# Altium schematic sheet Pedal_Power.SchDoc
size A3; SheetNumber: 1; SheetTotal: 1
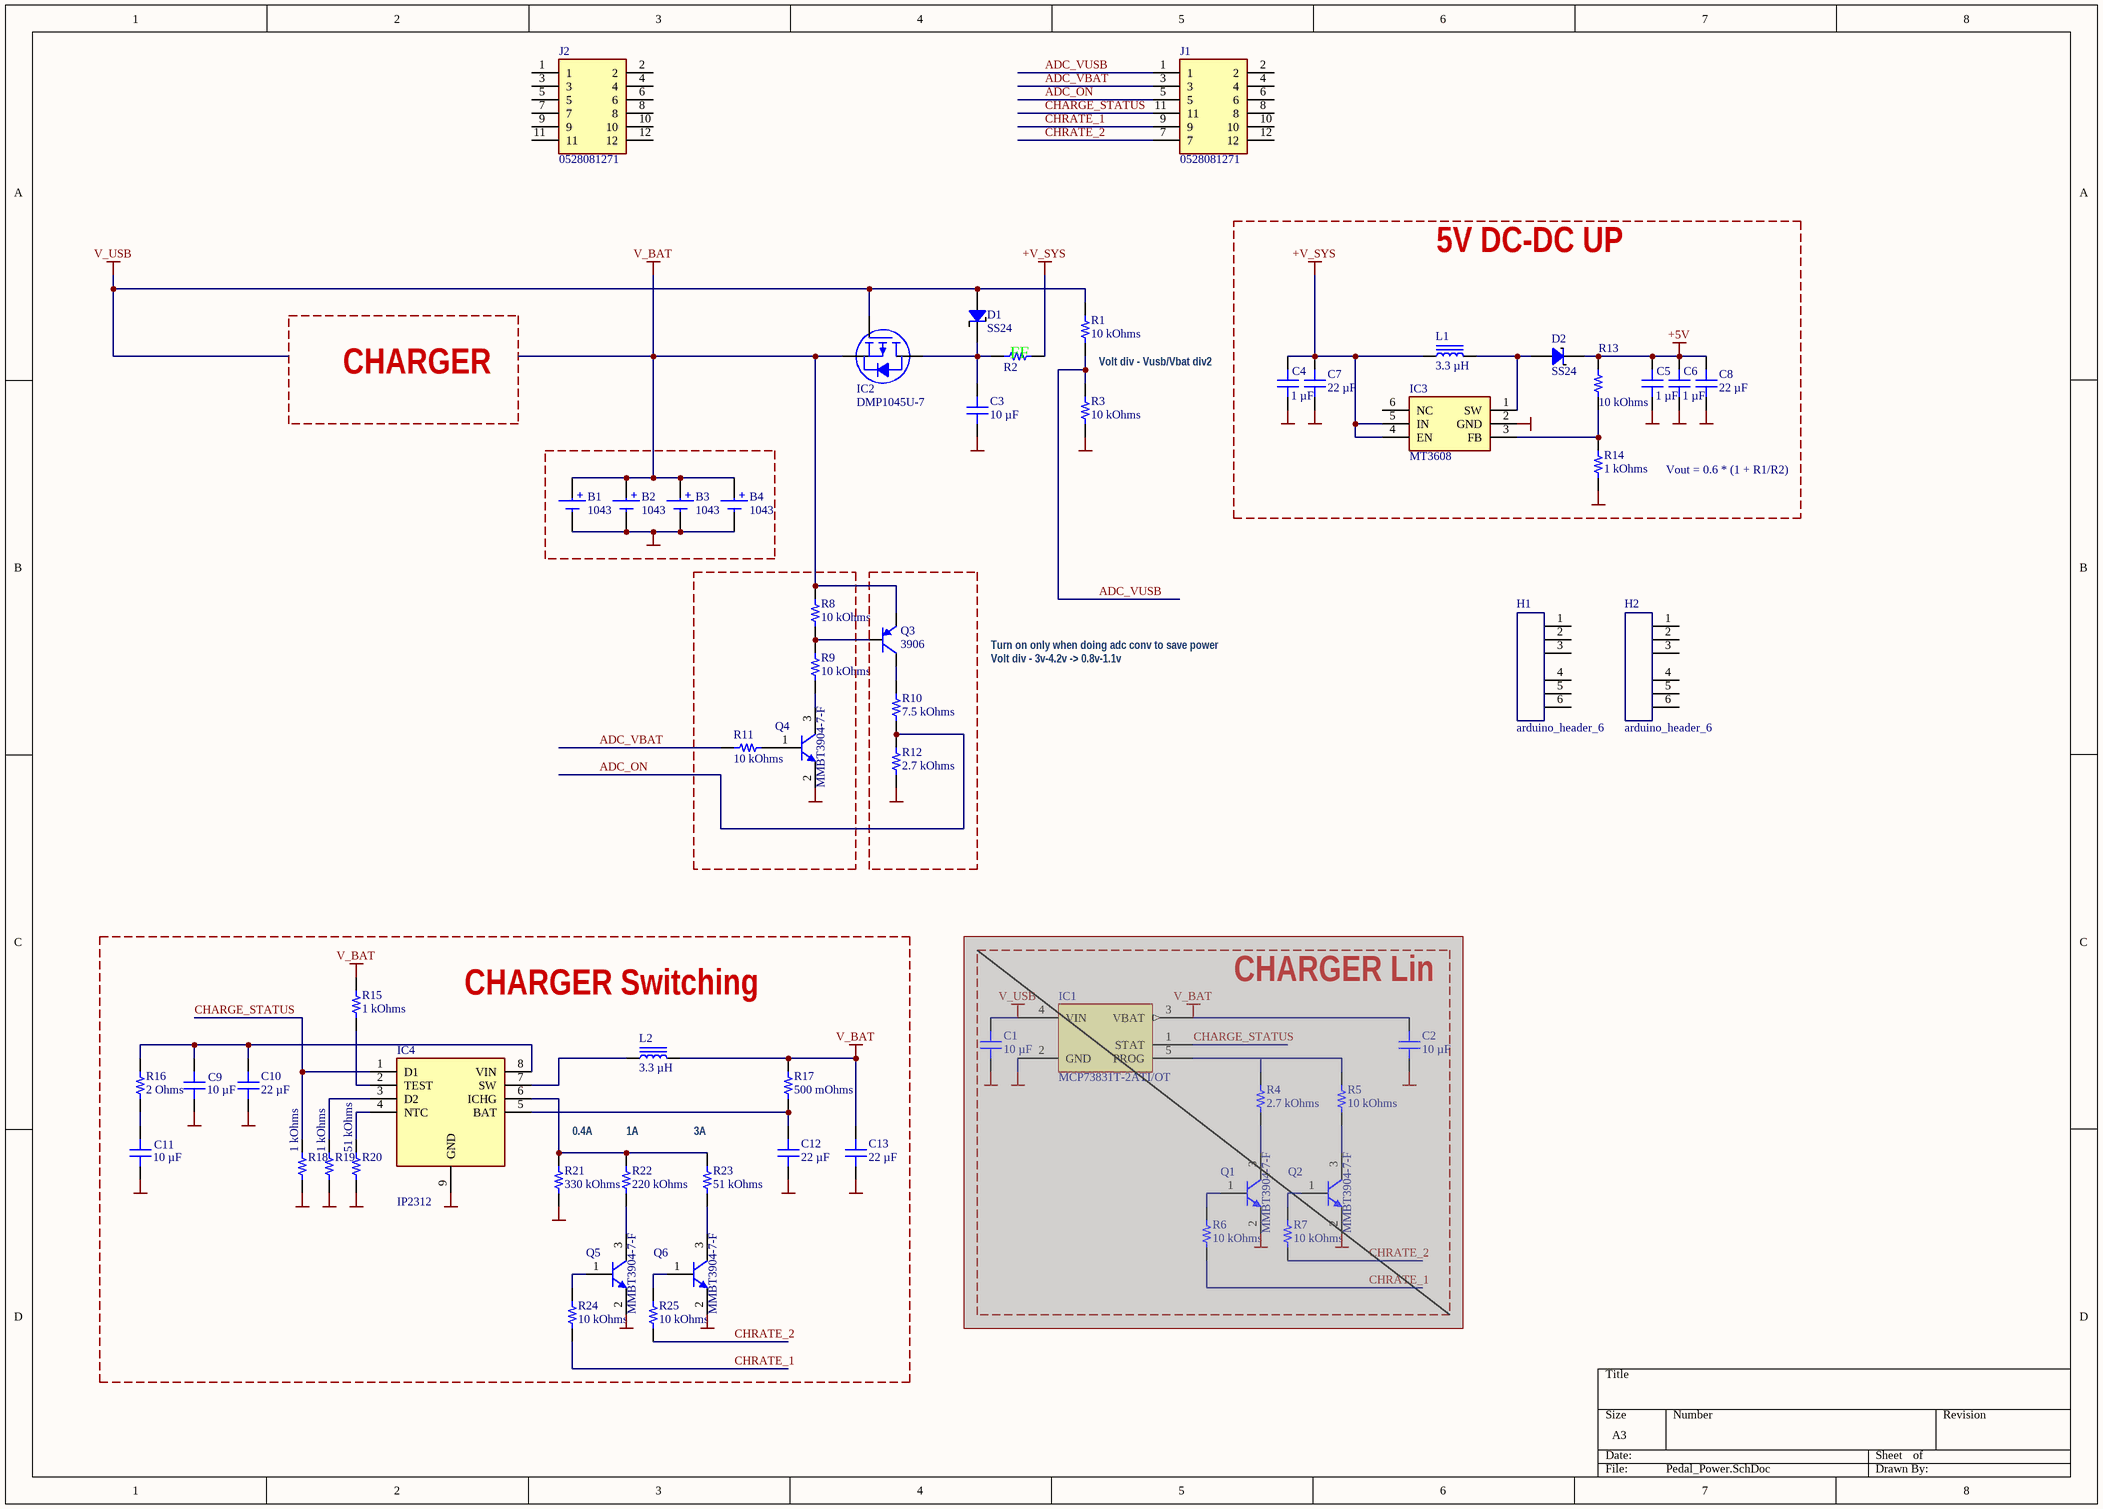
[diagram p0: Pedal_Power.SchDoc]

## Parts
B1  1043  [KEYSTONE 1043]
B2  1043  [KEYSTONE 1043]
B3  1043  [KEYSTONE 1043]
B4  1043  [KEYSTONE 1043]
C1  10 µF  [CAP 0805_2012]  (masked out: inside a compile mask, not in the netlist)
C2  10 µF  [CAP 0805_2012]  (masked out: inside a compile mask, not in the netlist)
C3  10 µF  [CAP 0805_2012]
C4  1 µF  [CAP 0805_2012]
C5  1 µF  [CAP 0805_2012]
C6  1 µF  [CAP 0805_2012]
C7  22 µF  [CAP 0805_2012]
C8  22 µF  [CAP 0805_2012]
C9  10 µF  [CAP 0805_2012]
C10  22 µF  [CAP 0805_2012]
C11  10 µF  [CAP 0805_2012]
C12  22 µF  [CAP 0805_2012]
C13  22 µF  [CAP 0805_2012]
D1  SS24  [DO214AA SMB]
D2  SS24  [DO214AA SMB]
H1  arduino_header_6  [header-6_male]
H2  arduino_header_6  [header-6_male]
IC1  MCP73831T-2ATI/OT  [MICROCHIP SOT-23-5 OT]  (masked out: inside a compile mask, not in the netlist)
IC2  DMP1045U-7  [DIODES SOT-23-3]
IC3  MT3608  [SOT95P280X145-6N]
IC4  IP2312  [SOIC127P600X165-9N]
J1  0528081271  [AFA11-S12GLA-00]
J2  0528081271  [AFA11-S12GLA-00]
L1  3.3 µH  [BOURNS SRR6028]
L2  3.3 µH  [BOURNS SRR6028]
Q1  MMBT3904-7-F  [DIODES SOT-23-3]  (masked out: inside a compile mask, not in the netlist)
Q2  MMBT3904-7-F  [DIODES SOT-23-3]  (masked out: inside a compile mask, not in the netlist)
Q3  3906  [SOT-23]
Q4  MMBT3904-7-F  [DIODES SOT-23-3]
Q5  MMBT3904-7-F  [DIODES SOT-23-3]
Q6  MMBT3904-7-F  [DIODES SOT-23-3]
R1  10 kOhms  [RES 0603_1608]
R2  (no value)  [RES 0603_1608]
R3  10 kOhms  [RES 0603_1608]
R4  2.7 kOhms  [RES 0603_1608]  (masked out: inside a compile mask, not in the netlist)
R5  10 kOhms  [RES 0603_1608]  (masked out: inside a compile mask, not in the netlist)
R6  10 kOhms  [RES 0603_1608]  (masked out: inside a compile mask, not in the netlist)
R7  10 kOhms  [RES 0603_1608]  (masked out: inside a compile mask, not in the netlist)
R8  10 kOhms  [RES 0603_1608]
R9  10 kOhms  [RES 0603_1608]
R10  7.5 kOhms  [RES 0603_1608]
R11  10 kOhms  [RES 0603_1608]
R12  2.7 kOhms  [RES 0603_1608]
R13  10 kOhms  [RES 0603_1608]
R14  1 kOhms  [RES 0603_1608]
R15  1 kOhms  [RES 0603_1608]
R16  2 Ohms  [RES 0603_1608]
R17  500 mOhms  [RES 0603_1608]
R18  1 kOhms  [RES 0603_1608]
R19  1 kOhms  [RES 0603_1608]
R20  51 kOhms  [RES 0603_1608]
R21  330 kOhms  [RES 0603_1608]
R22  220 kOhms  [RES 0603_1608]
R23  51 kOhms  [RES 0603_1608]
R24  10 kOhms  [RES 0603_1608]
R25  10 kOhms  [RES 0603_1608]

## Blocks framed on the sheet
5V DC-DC UP: C4-C8 D2 IC3 L1 R13 R14
CHARGER Switching: C9-C13 IC4 L2 Q5 Q6 R15-R25
CHARGER Lin: C1 C2 IC1 Q1 Q2 R4-R7

## Nets
+5V: C5.2 C6.2 C8.2 D2.2 R13.2
+V_SYS: C4.2 C7.2 IC3.4(EN) IC3.5(IN) L1.1 R2.1
GND: B1.2(-) B2.2(-) B3.2(-) B4.2(-) C3.1 C4.1 C5.1 C6.1 C7.1 C8.1 C9.1 C10.1 C11.1 C12.1 C13.1 IC3.2(GND) IC4.9(GND) Q4.2(E) Q5.2(E) Q6.2(E) R3.1 R12.1 R14.1 R18.2 R19.2 R20.1 R21.1
V_BAT: B1.1(+) B2.1(+) B3.1(+) B4.1(+) C13.2 IC2.2(S) L2.2 Q3.2(E) R8.2 R15.1 R17.2
V_USB: D1.1 IC2.1(G) R1.2
ADC_ON: J1.5 R10.1 R12.2
ADC_VBAT: J1.3 R11.2
ADC_VUSB: J1.1 R1.1 R3.2
CHARGE_STATUS: IC4.1(D1) J1.11 R18.1
CHRATE_1: J1.9 R24.1
CHRATE_2: J1.7 R25.1
NetC3_2: C3.2 D1.2 IC2.3(D) R2.2
NetC9_2: C9.2 C10.2 IC4.8(VIN) R16.2
NetC11_2: C11.2 R16.1
NetC12_2: C12.2 IC4.5(BAT) R17.1
NetD2_1: D2.1 IC3.1(SW) L1.2
NetIC3_3: IC3.3(FB) R13.1 R14.2
NetIC4_2: IC4.2(TEST) R15.2
NetIC4_3: IC4.3(D2) R19.1
NetIC4_4: IC4.4(NTC) R20.2
NetIC4_6: IC4.6(ICHG) R21.2 R22.2 R23.2
NetIC4_7: IC4.7(SW) L2.1
NetQ3_1: Q3.1(B) R8.1 R9.2
NetQ3_3: Q3.3(C) R10.2
NetQ4_1: Q4.1(B) R11.1
NetQ4_3: Q4.3(C) R9.1
NetQ5_1: Q5.1(B) R24.2
NetQ5_3: Q5.3(C) R22.1
NetQ6_1: Q6.1(B) R25.2
NetQ6_3: Q6.3(C) R23.1

Not connected (* = marked no-connect by the designer): H1 1 2 3 4 5 6; H2 1 2 3 4 5 6; IC3 6(NC); J1 2 4 6 8 10 12; J2 1 2 3 4 5 6 7 8 9 10 11 12

## Notes on the sheet
- CHARGER
- (near R2) FF
- Volt div - Vusb/Vbat div2
- Vout = 0.6 * (1 + R1/R2)
- Turn on only when doing adc conv to save power
- Volt div - 3v-4.2v -> 0.8v-1.1v
- 0.4A
- (near R22) 1A
- (near R23) 3A

## Library data of the parts
B1-B4 = 1043: BATTERY HOLDER 18650 PC PIN; Manufacturer: Keystone Electronics; Battery Cell Size: 18650; Battery Type, Function: Cylindrical, Holder; Number of Cells: 1; Style: Holder (Open); Part Number: 1043; ComponentLink1Description: Datasheet; ComponentLink1URL: http://keyelco.com/userAssets/file/M65p27.pdf; ComponentLink2Description: DigiKey Link; ComponentLink2URL: http://digikey.com/product-detail/en/keystone-electronics/1043/36-1043-ND/2745669; Height Above Board: 0.585" (14.86mm); LastUpdated: 2/2/2020 9:19:56 AM; Lifecycle Status: Active; Minimum Order: 1; Mounting Type: PCB, Through Hole; Operating Temperature: -50°C ~ 145°C; Packaging: Unknown; PartId: 2; Part Status: Active; Price: 2.58; Series: -; Supplier 1: DigiKey; Supplier Part Number 1: 36-1043-ND; Termination Style: PC Pin
C1-C3 C9 C11 = C0805C106K8PAC7800: CAP CER 10UF 10V X5R 0805; manufacturer: KEMET; Tolerance: ±10%; Part Number: C0805C106K8PAC7800; Value: 10 µF; Applications: Bypass, Decoupling; Capacitance: 10 µF; componentlink1description: Datasheet; componentlink1url: https://connect.kemet.com:7667/gateway/IntelliData-ComponentDocumentation/1.0/download/datasheet/C0805C106K8PACTU; componentlink2description: DigiKey Link; componentlink2url: https://www.digikey.com/en/products/detail/kemet/C0805C106K8PAC7800/1090830; Device Package: 0805 (2012 Metric); lastupdated: 9/14/2022 7:51:56 AM; Lifecycle Status: Active; Minimum Order: 1; Mounting Type: Surface Mount, MLCC; Operating Temperature: -55°C ~ 85°C; Package / Case: 0805 (2012 Metric); packaging: TapeAndReel; partid: 44790; Part Status: Active; price: 0.02; series: SMD Comm X5R; Size / Dimension: 0.079" L x 0.049" W (2.00mm x 1.25mm); Supplier 1: DigiKey; Supplier Part Number 1: 399-C0805C106K8PAC7800CT-ND; Temperature Coefficient: X5R; Thickness (Max): 0.055" (1.40mm); Voltage - Rated: 10V
C4-C6 = C0805C105K4RAC7800: CAP CER 1UF 16V X7R 0805; manufacturer: KEMET; Tolerance: ±10%; Part Number: C0805C105K4RAC7800; Value: 1 µF; Applications: Bypass, Decoupling; Capacitance: 1 µF; componentlink1description: Datasheet; componentlink1url: https://api.kemet.com/component-edge/download/datasheet/C0805C105K4RACTU.pdf; componentlink2description: DigiKey Link; componentlink2url: https://www.digikey.com/en/products/detail/kemet/C0805C105K4RAC7800/416047; Device Package: 0805 (2012 Metric); lastupdated: 9/19/2022 1:03:30 PM; Lifecycle Status: Active; Minimum Order: 1; Mounting Type: Surface Mount, MLCC; Operating Temperature: -55°C ~ 125°C; Package / Case: 0805 (2012 Metric); packaging: TapeAndReel; partid: 32075; Part Status: Active; price: 0.01; series: SMD Comm X7R; Size / Dimension: 0.079" L x 0.049" W (2.00mm x 1.25mm); Supplier 1: DigiKey; Supplier Part Number 1: 399-C0805C105K4RAC7800CT-ND; Temperature Coefficient: X7R; Thickness (Max): 0.039" (1.00mm); Voltage - Rated: 16V
C7 C8 C10 C12 C13 = GRM21BR61E226ME44K: CAP CER 22UF 25V X5R 0805; manufacturer: Murata Electronics; Tolerance: ±20%; Part Number: GRM21BR61E226ME44K; Value: 22 µF; Applications: General Purpose; Capacitance: 22 µF; componentlink1description: Datasheet; componentlink1url: https://search.murata.co.jp/Ceramy/image/img/A01X/G101/ENG/GRM21BR61E226ME44-01.pdf; componentlink2description: DigiKey Link; componentlink2url: https://www.digikey.com/en/products/detail/murata-electronics/GRM21BR61E226ME44K/4905534; Device Package: 0805 (2012 Metric); lastupdated: 2/9/2024 8:15:53 PM; Lifecycle Status: Active; Minimum Order: 1; Mounting Type: Surface Mount, MLCC; Operating Temperature: -55°C ~ 85°C; Package / Case: 0805 (2012 Metric); packaging: TapeAndReel; partid: 39870; Part Status: Active; price: 0.05; series: GRM; Size / Dimension: 0.079" L x 0.049" W (2.00mm x 1.25mm); Supplier 1: DigiKey; Supplier Part Number 1: 490-14661-1-ND; Temperature Coefficient: X5R; Thickness (Max): 0.057" (1.45mm); Voltage - Rated: 25V
D1 D2 = SS24: DIODE SCHOTTKY 40V 2A DO214AA; Manufacturer: ON Semiconductor; Current - Reverse Leakage @ Vr: 400µA @ 40V; Speed: Fast Recovery =< 500ns, > 200mA (Io); Voltage - Forward (Vf) (Max) @ If: 500mV @ 2A; Part Number: SS24; ComponentLink1Description: Datasheet; ComponentLink1URL: https://www.onsemi.com/pub/Collateral/SS29-D.pdf; ComponentLink2Description: DigiKey Link; ComponentLink2URL: http://digikey.com/product-detail/en/on-semiconductor/SS24/SS24FSCT-ND/1626273; Current - Average Rectified (Io): 2A; Diode Type: Schottky; LastUpdated: 2/8/2024 9:26:46 PM; Lifecycle Status: Active; Minimum Order: 1; Mounting Type: Surface Mount; Operating Temperature - Junction: -65°C ~ 125°C; Package / Case: DO-214AA, SMB; Packaging: TapeAndReel; PartId: 1394; Part Status: Active; Price: 0.10; Series: -; Supplier 1: DigiKey; Supplier Part Number 1: SS24FSCT-ND; Supplier Device Package: DO-214AA (SMB); Voltage - DC Reverse (Vr) (Max): 40V
IC1 = MCP73831T-2ATI/OT: IC CONTROLLR LI-ION 4.2V SOT23-5; Manufacturer: Microchip Technology; Battery Chemistry: Lithium Ion/Polymer; Charge Current - Max: 500mA; Current - Charging: Constant - Programmable; Fault Protection: Over Voltage; Number of Cells: 1; Programmable Features: Current; Voltage - Supply (Max): 6V; Part Number: MCP73831T-2ATI/OT; Battery Pack Voltage: 4.2V; ComponentLink1Description: Datasheet; ComponentLink1URL: http://ww1.microchip.com/downloads/en/DeviceDoc/20001984g.pdf; ComponentLink2Description: DigiKey Link; ComponentLink2URL: //digikey.com/product-detail/en/microchip-technology/MCP73831T-2ATI-OT/MCP73831T-2ATI-OTTR-ND/964303; Device Package: SC-74A, SOT-753; LastUpdated: 12/3/2019 11:33:03 PM; Lifecycle Status: 0; Minimum Order: 1; Mounting Type: Surface Mount; Operating Temperature: -40°C ~ 85°C (TA); Package / Case: SC-74A, SOT-753; Packaging: TapeAndReel; PartId: 1; Part Status: Active; Price: 0.42; Series: -; Supplier 1: DigiKey; Supplier Part Number 1: MCP73831T-2ATI/OTTR-ND; Supplier Device Package: SOT-23-5
IC2 = DMP1045U-7: MOSFET P-CH 12V 4A SOT23; Manufacturer: Diodes Incorporated; Current - Continuous Drain (Id) @ 25°C: 4A (Ta); Drive Voltage (Max Rds On,  Min Rds On): 1.8V, 4.5V; FET Type: P-Channel; Gate Charge (Qg) (Max) @ Vgs: 15.8 nC @ 4.5 V; Input Capacitance (Ciss) (Max) @ Vds: 1357 pF @ 10 V; Power Dissipation (Max): 800mW (Ta); Rds On (Max) @ Id, Vgs: 31mOhm @ 4A, 4.5V; Vgs (Max): ±8V; Vgs(th) (Max) @ Id: 1V @ 250µA; Part Number: DMP1045U-7; ComponentLink1Description: Datasheet; ComponentLink1URL: https://www.diodes.com/assets/Datasheets/DMP1045U.pdf; ComponentLink2Description: DigiKey Link; ComponentLink2URL: https://www.digikey.com/en/products/detail/diodes-incorporated/DMP1045U-7/4249936; Drain to Source Voltage (Vdss): 12 V; LastUpdated: 2/8/2024 9:46:13 PM; Lifecycle Status: Active; Minimum Order: 1; Mounting Type: Surface Mount; Operating Temperature: -55°C ~ 150°C (TJ); Package / Case: TO-236-3, SC-59, SOT-23-3; Packaging: TapeAndReel; Part Status: Active; Price: 0.07; Series: -; Supplier 1: DigiKey; Supplier Part Number 1: DMP1045U-7DICT-ND; Supplier Device Package: SOT-23-3; Technology: MOSFET (Metal Oxide)
IC3 = MT3608: Integrated Circuit; Manufacturer_Name: Aerosemi; Datasheet Link: https://www.olimex.com/Products/Breadboarding/BB-PWR-3608/resources/MT3608.pdf; Height: 1.45mm; Manufacturer_Part_Number: MT3608
IC4 = IP2312: Integrated Circuit; Manufacturer_Name: INJOINIC; Datasheet Link: http://www.injoinic.com/wwwroot/uploads/files/20230913/623558e526750db62e25e32800f94a6b.pdf; Height: 1.65mm; Manufacturer_Part_Number: IP2312
J1 J2 = 0528081271: Connector; Manufacturer_Name: Molex; Datasheet Link: https://www.molex.com/pdm_docs/sd/528082071_sd.pdf; Height: 5.3mm; Manufacturer_Part_Number: 0528081271
L1 L2 = SRR6028-3R3Y: FIXED IND 3.3UH 2.5A 28 MOHM SMD; Manufacturer: Bourns Inc.; Current - Saturation: 2.6A; DC Resistance (DCR): 28mOhm Max; Frequency - Self Resonant: 45MHz; Inductance Frequency - Test: 100 kHz; Material - Core: Ferrite; Q @ Freq: 10 @ 7.96MHz; Shielding: Shielded; Tolerance: ±30%; Type: Drum Core, Wirewound; Part Number: SRR6028-3R3Y; ComponentLink1Description: Datasheet; ComponentLink1URL: https://www.bourns.com/docs/Product-Datasheets/SRR6028.pdf; ComponentLink2Description: DigiKey Link; ComponentLink2URL: https://www.digikey.com/en/products/detail/bourns-inc/SRR6028-3R3Y/1970369; Current Rating (Amps): 2.5 A; Device Package: Nonstandard; Height - Seated (Max): 0.118" (3.00mm); Inductance: 3.3 µH; LastUpdated: 2/8/2024 9:34:55 PM; Lifecycle Status: Active; Minimum Order: 1; Mounting Type: Surface Mount; Operating Temperature: -40°C ~ 125°C; Package / Case: Nonstandard; Packaging: TapeAndReel; PartId: 57; Part Status: Active; Price: 0.31; Series: SRR6028; Size / Dimension: 0.268" L x 0.268" W (6.80mm x 6.80mm); Supplier 1: DigiKey; Supplier Part Number 1: 118-SRR6028-3R3YCT-ND; Value: 3.3 µH
Q1 Q2 Q4-Q6 = MMBT3904-7-F: TRANS NPN 40V 0.2A SOT23-3; Manufacturer: Diodes Incorporated; Current - Collector Cutoff (Max): 50nA (ICBO); Current - Collector (Ic) (Max): 200 mA; DC Current Gain (hFE) (Min) @ Ic, Vce: 100 @ 10mA, 1V; Frequency - Transition: 300MHz; Power - Max: 300 mW; Vce Saturation (Max) @ Ib, Ic: 300mV @ 5mA, 50mA; Part Number: MMBT3904-7-F; ComponentLink1Description: Datasheet; ComponentLink1URL: https://www.diodes.com/assets/Datasheets/ds30036.pdf; ComponentLink2Description: DigiKey Link; ComponentLink2URL: https://www.digikey.com/en/products/detail/diodes-incorporated/MMBT3904-7-F/814494; LastUpdated: 2/8/2024 9:54:04 PM; Lifecycle Status: Active; Minimum Order: 1; Mounting Type: Surface Mount; Operating Temperature: -55°C ~ 150°C (TJ); Package / Case: TO-236-3, SC-59, SOT-23-3; Packaging: TapeAndReel; PartId: 85; Part Status: Active; Price: 0.01; Series: -; Supplier 1: DigiKey; Supplier Part Number 1: MMBT3904-FDICT-ND; Supplier Device Package: SOT-23-3; Transistor Type: NPN; Voltage - Collector Emitter Breakdown (Max): 40 V
Q3 = MMBT3906
R1 R3 R5-R9 R11 R13 R24 R25 = RT0603FRE0710KL: RES SMD 10K OHM 1% 1/10W 0603; Manufacturer: Yageo; Power (Watts): 0.1W, 1/10W; Temperature Coefficient: ±50ppm/°C; Part Number: RT0603FRE0710KL; Value: 10 kOhms; ComponentLink1Description: Datasheet; ComponentLink1URL: https://www.yageo.com/upload/media/product/productsearch/datasheet/rchip/PYu-RT_1-to-0.01_RoHS_L_11.pdf; ComponentLink2Description: DigiKey Link; ComponentLink2URL: http://digikey.com/product-detail/en/yageo/RT0603FRE0710KL/YAG2321CT-ND/5252435; Composition: Thin Film; Device Package: 0603 (1608 Metric); Height - Seated (Max): 0.022" (0.55mm); LastUpdated: 9/2/2020 1:10:23 AM; Lifecycle Status: Active; Minimum Order: 1; Number of Terminations: 2; Operating Temperature: -55°C ~ 155°C; Package / Case: 0603 (1608 Metric); Packaging: TapeAndReel; PartId: 5671; Part Status: Active; Price: 0.01; Resistance: 10 kOhms; Series: RT; Size / Dimension: 0.063" L x 0.031" W (1.60mm x 0.80mm); Supplier 1: DigiKey; Supplier Part Number 1: YAG2321CT-ND; Supplier Device Package: 0603; Tolerance: ±1%
R2 = RCA06030000ZSEA: RES SMD 0 OHM JUMPER 1/10W 0603; Manufacturer: Vishay Dale; Power (Watts): 0.1W, 1/10W; Part Number: RCA06030000ZSEA; ComponentLink1Description: Datasheet; ComponentLink1URL: http://www.vishay.com/docs/20037/rcae3.pdf; ComponentLink2Description: DigiKey Link; ComponentLink2URL: http://digikey.com/product-detail/en/vishay-dale/RCA06030000ZSEA/541-2192-1-ND/4946845; Composition: Thick Film; Device Package: 0603 (1608 Metric); Features: Anti-Sulfur, Automotive AEC-Q200; Height - Seated (Max): 0.020" (0.50mm); LastUpdated: 9/2/2020 1:10:23 AM; Lifecycle Status: Active; Minimum Order: 1; Number of Terminations: 2; Operating Temperature: -55°C ~ 155°C; Package / Case: 0603 (1608 Metric); Packaging: TapeAndReel; PartId: 5740; Part Status: Active; Price: 0.01; Ratings: AEC-Q200; Series: RCA; Size / Dimension: 0.061" L x 0.033" W (1.55mm x 0.85mm); Supplier 1: DigiKey; Supplier Part Number 1: 541-2192-1-ND; Supplier Device Package: 0603; Tolerance: Jumper
R4 R12 = RC0603FR-072K7L: RES 2.7K OHM 1% 1/10W 0603; Manufacturer: Yageo; Power (Watts): 0.1W, 1/10W; Temperature Coefficient: ±100ppm/°C; Part Number: RC0603FR-072K7L; Value: 2.7 kOhms; ComponentLink1Description: Datasheet; ComponentLink1URL: https://www.yageo.com/upload/media/product/productsearch/datasheet/rchip/PYu-RC_Group_51_RoHS_L_10.pdf; ComponentLink2Description: DigiKey Link; ComponentLink2URL: https://www.digikey.com/en/products/detail/yageo/RC0603FR-072K7L/727032; Composition: Thick Film; Device Package: 0603 (1608 Metric); Features: Moisture Resistant; Height - Seated (Max): 0.022" (0.55mm); LastUpdated: 2/9/2024 8:42:41 PM; Lifecycle Status: Active; Minimum Order: 1; Number of Terminations: 2; Operating Temperature: -55°C ~ 155°C; Package / Case: 0603 (1608 Metric); Packaging: CutTape; PartId: 19013; Part Status: Active; Price: 0.01; Resistance: 2.7 kOhms; Series: RC_L; Size / Dimension: 0.063" L x 0.031" W (1.60mm x 0.80mm); Supplier 1: DigiKey; Supplier Part Number 1: 311-2.70KHRCT-ND; Supplier Device Package: 0603; Tolerance: ±1%
R10 = RC0603FR-077K5L: RES 7.5K OHM 1% 1/10W 0603; Manufacturer: Yageo; Power (Watts): 0.1W, 1/10W; Temperature Coefficient: ±100ppm/°C; Part Number: RC0603FR-077K5L; Value: 7.5 kOhms; ComponentLink1Description: Datasheet; ComponentLink1URL: https://www.yageo.com/upload/media/product/productsearch/datasheet/rchip/PYu-RC_Group_51_RoHS_L_10.pdf; ComponentLink2Description: DigiKey Link; ComponentLink2URL: https://www.digikey.com/en/products/detail/yageo/RC0603FR-077K5L/727366; Composition: Thick Film; Device Package: 0603 (1608 Metric); Features: Moisture Resistant; Height - Seated (Max): 0.022" (0.55mm); LastUpdated: 2/9/2024 8:42:41 PM; Lifecycle Status: Active; Minimum Order: 1; Number of Terminations: 2; Operating Temperature: -55°C ~ 155°C; Package / Case: 0603 (1608 Metric); Packaging: CutTape; PartId: 19041; Part Status: Active; Price: 0.01; Resistance: 7.5 kOhms; Series: RC_L; Size / Dimension: 0.063" L x 0.031" W (1.60mm x 0.80mm); Supplier 1: DigiKey; Supplier Part Number 1: 311-7.50KHRCT-ND; Supplier Device Package: 0603; Tolerance: ±1%
R14 = RT0603FRE071KL: RES SMD 1K OHM 1% 1/10W 0603; Manufacturer: Yageo; Power (Watts): 0.1W, 1/10W; Temperature Coefficient: ±50ppm/°C; Part Number: RT0603FRE071KL; Value: 1 kOhms; ComponentLink1Description: Datasheet; ComponentLink1URL: https://www.yageo.com/upload/media/product/productsearch/datasheet/rchip/PYu-RT_1-to-0.01_RoHS_L_11.pdf; ComponentLink2Description: DigiKey Link; ComponentLink2URL: https://www.digikey.com/en/products/detail/yageo/RT0603FRE071KL/1075188; Composition: Thin Film; Device Package: 0603 (1608 Metric); Height - Seated (Max): 0.022" (0.55mm); LastUpdated: 9/19/2022 1:22:31 PM; Lifecycle Status: Active; Minimum Order: 1; Number of Terminations: 2; Operating Temperature: -55°C ~ 155°C; Package / Case: 0603 (1608 Metric); Packaging: TapeAndReel; PartId: 5672; Part Status: Active; Price: 0.01; Resistance: 1 kOhms; Series: RT; Size / Dimension: 0.063" L x 0.031" W (1.60mm x 0.80mm); Supplier 1: DigiKey; Supplier Part Number 1: YAG2323CT-ND; Supplier Device Package: 0603; Tolerance: ±1%
R15 R18 R19 = RC0603JR-071KP: RES 1K OHM 5% 1/10W 0603; Manufacturer: Yageo; Power (Watts): 0.1W, 1/10W; Ratings: 7C1 RoHS w/out Exemption (100% Pb-Free); Temperature Coefficient: ±100ppm/°C; Part Number: RC0603JR-071KP; Value: 1 kOhms; ComponentLink1Description: Datasheet; ComponentLink1URL: http://www.yageo.com/NewPortal/yageodocoutput?fileName=/pdf/R-Chip/PYu-RC_51_RoHS_P_0.pdf; ComponentLink2Description: DigiKey Link; ComponentLink2URL: https://www.digikey.com/en/products/detail/yageo/RC0603JR-071KP/4935326; Composition: Thick Film; Device Package: 0603 (1608 Metric); Features: Moisture Resistant; Height - Seated (Max): 0.022" (0.55mm); LastUpdated: 2/9/2024 8:43:09 PM; Lifecycle Status: Active; Minimum Order: 1; Number of Terminations: 2; Operating Temperature: -55°C ~ 155°C; Package / Case: 0603 (1608 Metric); Packaging: TapeAndReel; PartId: 11731; Part Status: Active; Price: 0.01; Resistance: 1 kOhms; Series: RC_P; Size / Dimension: 0.063" L x 0.031" W (1.60mm x 0.80mm); Supplier 1: DigiKey; Supplier Part Number 1: YAG1311CT-ND; Supplier Device Package: 0603; Tolerance: ±5%
R16 = RC0603FR-072RL: RES 2 OHM 1% 1/10W 0603; Manufacturer: Yageo; Power (Watts): 0.1W, 1/10W; Temperature Coefficient: ±200ppm/°C; Part Number: RC0603FR-072RL; Value: 2 Ohms; ComponentLink1Description: Datasheet; ComponentLink1URL: https://www.yageo.com/upload/media/product/productsearch/datasheet/rchip/PYu-RC_Group_51_RoHS_L_10.pdf; ComponentLink2Description: DigiKey Link; ComponentLink2URL: https://www.digikey.com/en/products/detail/yageo/RC0603FR-072RL/727008; Composition: Thick Film; Device Package: 0603 (1608 Metric); Features: Moisture Resistant; Height - Seated (Max): 0.022" (0.55mm); LastUpdated: 2/9/2024 8:43:04 PM; Lifecycle Status: Active; Minimum Order: 1; Number of Terminations: 2; Operating Temperature: -55°C ~ 155°C; Package / Case: 0603 (1608 Metric); Packaging: TapeAndReel; PartId: 12910; Part Status: Active; Price: 0.01; Resistance: 2 Ohms; Series: RC_L; Size / Dimension: 0.063" L x 0.031" W (1.60mm x 0.80mm); Supplier 1: DigiKey; Supplier Part Number 1: 311-2.00HRCT-ND; Supplier Device Package: 0603; Tolerance: ±1%
R17 = RL0603FR-070R5L: RES 0.5 OHM 1% 1/10W 0603; Manufacturer: Yageo; Power (Watts): 0.1W, 1/10W; Temperature Coefficient: ±800ppm/°C; Part Number: RL0603FR-070R5L; Value: 500 mOhms; ComponentLink1Description: Datasheet; ComponentLink1URL: http://www.yageo.com/documents/recent/PYu-RL_Group_521_RoHS_L_2.pdf; ComponentLink2Description: DigiKey Link; ComponentLink2URL: https://www.digikey.com/en/products/detail/yageo/RL0603FR-070R5L/3885517; Composition: Thick Film; Device Package: 0603 (1608 Metric); Features: Automotive AEC-Q200, Current Sense, Moisture Resistant; Height - Seated (Max): 0.022" (0.55mm); LastUpdated: 2/9/2024 8:43:08 PM; Lifecycle Status: Active; Minimum Order: 1; Number of Terminations: 2; Operating Temperature: -55°C ~ 155°C; Package / Case: 0603 (1608 Metric); Packaging: TapeAndReel; PartId: 12049; Part Status: Active; Price: 0.03; Ratings: AEC-Q200; Resistance: 500 mOhms; Series: RL; Size / Dimension: 0.063" L x 0.031" W (1.60mm x 0.80mm); Supplier 1: DigiKey; Supplier Part Number 1: 311-.5QCT-ND; Supplier Device Package: 0603; Tolerance: ±1%
R20 R23 = RC0603FR-0751KL: RES 51K OHM 1% 1/10W 0603; Manufacturer: Yageo; Power (Watts): 0.1W, 1/10W; Temperature Coefficient: ±100ppm/°C; Part Number: RC0603FR-0751KL; Value: 51 kOhms; ComponentLink1Description: Datasheet; ComponentLink1URL: https://www.yageo.com/upload/media/product/productsearch/datasheet/rchip/PYu-RC_Group_51_RoHS_L_10.pdf; ComponentLink2Description: DigiKey Link; ComponentLink2URL: https://www.digikey.com/en/products/detail/yageo/RC0603FR-0751KL/727282; Composition: Thick Film; Device Package: 0603 (1608 Metric); Features: Moisture Resistant; Height - Seated (Max): 0.022" (0.55mm); LastUpdated: 2/9/2024 8:42:42 PM; Lifecycle Status: Active; Minimum Order: 1; Number of Terminations: 2; Operating Temperature: -55°C ~ 155°C; Package / Case: 0603 (1608 Metric); Packaging: CutTape; PartId: 18942; Part Status: Active; Price: 0.01; Resistance: 51 kOhms; Series: RC_L; Size / Dimension: 0.063" L x 0.031" W (1.60mm x 0.80mm); Supplier 1: DigiKey; Supplier Part Number 1: 311-51.0KHRCT-ND; Supplier Device Package: 0603; Tolerance: ±1%
R21 = RC0603JR-07330KL: RES 330K OHM 5% 1/10W 0603; Manufacturer: Yageo; Power (Watts): 0.1W, 1/10W; Temperature Coefficient: ±100ppm/°C; Part Number: RC0603JR-07330KL; Value: 330 kOhms; ComponentLink1Description: Datasheet; ComponentLink1URL: https://www.yageo.com/upload/media/product/productsearch/datasheet/rchip/PYu-RC_Group_51_RoHS_L_10.pdf; ComponentLink2Description: DigiKey Link; ComponentLink2URL: https://www.digikey.com/en/products/detail/yageo/RC0603JR-07330KL/726770; Composition: Thick Film; Device Package: 0603 (1608 Metric); Features: Moisture Resistant; Height - Seated (Max): 0.022" (0.55mm); LastUpdated: 2/9/2024 8:42:48 PM; Lifecycle Status: Active; Minimum Order: 1; Number of Terminations: 2; Operating Temperature: -55°C ~ 155°C; Package / Case: 0603 (1608 Metric); Packaging: CutTape; PartId: 17213; Part Status: Active; Price: 0.01; Resistance: 330 kOhms; Series: RC_L; Size / Dimension: 0.063" L x 0.031" W (1.60mm x 0.80mm); Supplier 1: DigiKey; Supplier Part Number 1: 311-330KGRCT-ND; Supplier Device Package: 0603; Tolerance: ±5%
R22 = RC0603FR-07220KL: RES 220K OHM 1% 1/10W 0603; Manufacturer: Yageo; Power (Watts): 0.1W, 1/10W; Temperature Coefficient: ±100ppm/°C; Part Number: RC0603FR-07220KL; Value: 220 kOhms; ComponentLink1Description: Datasheet; ComponentLink1URL: https://www.yageo.com/upload/media/product/productsearch/datasheet/rchip/PYu-RC_Group_51_RoHS_L_10.pdf; ComponentLink2Description: DigiKey Link; ComponentLink2URL: https://www.digikey.com/en/products/detail/yageo/RC0603FR-07220KL/727062; Composition: Thick Film; Device Package: 0603 (1608 Metric); Features: Moisture Resistant; Height - Seated (Max): 0.022" (0.55mm); LastUpdated: 2/9/2024 8:42:41 PM; Lifecycle Status: Active; Minimum Order: 1; Number of Terminations: 2; Operating Temperature: -55°C ~ 155°C; Package / Case: 0603 (1608 Metric); Packaging: CutTape; PartId: 19015; Part Status: Active; Price: 0.01; Resistance: 220 kOhms; Series: RC_L; Size / Dimension: 0.063" L x 0.031" W (1.60mm x 0.80mm); Supplier 1: DigiKey; Supplier Part Number 1: 311-220KHRCT-ND; Supplier Device Package: 0603; Tolerance: ±1%